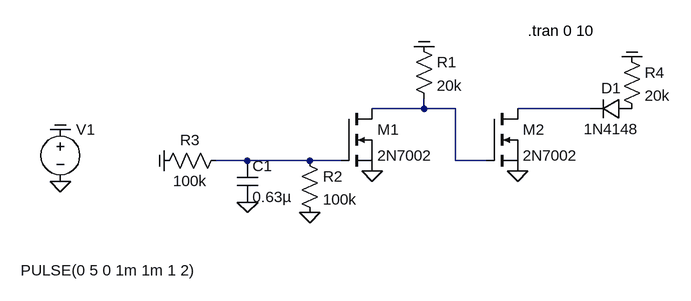
[diagram p0: schematic reset.asc]
reset.asc, the LTspice schematic file:
Version 4
SHEET 1 880 680
WIRE 496 224 496 208
WIRE 496 224 416 224
WIRE 544 224 496 224
WIRE 752 224 640 224
WIRE 224 304 176 304
WIRE 320 304 224 304
WIRE 368 304 320 304
WIRE 544 304 544 224
WIRE 592 304 544 304
FLAG 224 368 0
FLAG 320 384 0
FLAG 416 320 0
FLAG 640 320 0
FLAG -64 336 0
FLAG 496 128 COM
FLAG 96 304 COM
FLAG -64 256 COM
FLAG 816 144 COM
SYMBOL nmos 368 224 R0
SYMATTR InstName M1
SYMATTR Value 2N7002
SYMBOL nmos 592 224 R0
SYMATTR InstName M2
SYMATTR Value 2N7002
SYMBOL res 480 112 R0
SYMATTR InstName R1
SYMATTR Value 20k
SYMBOL res 304 288 R0
SYMATTR InstName R2
SYMATTR Value 100k
SYMBOL res 192 288 R90
WINDOW 0 0 56 VBottom 2
WINDOW 3 32 56 VTop 2
SYMATTR InstName R3
SYMATTR Value 100k
SYMBOL cap 208 304 R0
SYMATTR InstName C1
SYMATTR Value 0.63µ
SYMBOL voltage -64 240 R0
WINDOW 3 -61 233 Left 2
SYMATTR InstName V1
SYMATTR Value PULSE(0 5 0 1m 1m 1 2)
SYMBOL diode 816 208 R90
WINDOW 0 0 32 VBottom 2
WINDOW 3 32 32 VTop 2
SYMATTR InstName D1
SYMATTR Value 1N4148
SYMBOL res 800 128 R0
SYMATTR InstName R4
SYMATTR Value 20k
TEXT 656 104 Left 2 !.tran 0 10

The netlist it stands for:
* reset.asc
M1 N001 N003 0 0 2N7002
M2 N002 N001 0 0 2N7002
R1 COM N001 20k
R2 N003 0 100k
R3 N003 COM 100k
C1 N003 0 0.63µ
V1 COM 0 PULSE(0 5 0 1m 1m 1 2)
D1 P001 N002 1N4148
R4 COM P001 20k
.model D D
.lib standard.dio
.model NMOS NMOS
.model PMOS PMOS
.lib standard.mos
.tran 0 10
.backanno
.end